# Altium project sonar_board_rev_2013A.PrjPcb
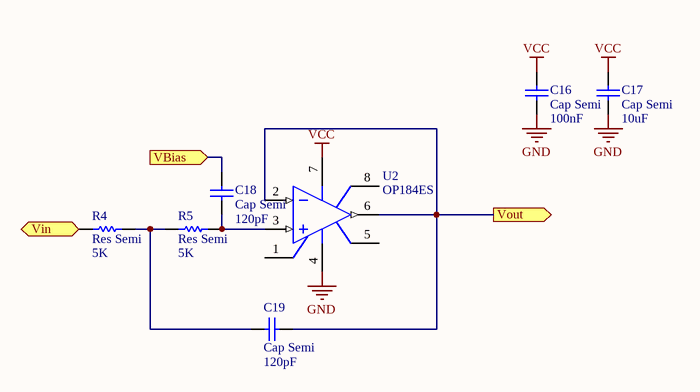
[diagram p0: Sallen_key_LPF.SchDoc]
8 sheets, 123 parts. Net scope: hierarchical (ports join the sheet entries above them; power ports are global).
Board file: Sonar_board.PcbDoc
Sheets:
  Sallen_key_LPF.SchDoc
  sonar_board_rev_2013A.SchDoc
    Pair_A = prototype_dual_channel.SchDoc
      Single_channel_VMA = voltage_mode_preamplifier.SchDoc
      Single_channel_VMA2 = voltage_mode_preamplifier.SchDoc
      Biasing_circuitry = bias_LNA.SchDoc
      Biasing_circuitry = bias_LNA.SchDoc
    Pair_B = prototype_dual_channel.SchDoc
      Single_channel_VMA = voltage_mode_preamplifier.SchDoc
      Single_channel_VMA2 = voltage_mode_preamplifier.SchDoc
      Biasing_circuitry = bias_LNA.SchDoc
      Biasing_circuitry = bias_LNA.SchDoc
    Stack_breakout = main_stack_dual_channel.SchDoc
    ADC_power = power_management.SchDoc
    sonar_extras = sonar_peripherals.SchDoc

## Sheet Sallen_key_LPF.SchDoc
size A

### Parts
C16  Cap Semi  value 100nF  [C0805]
C17  Cap Semi  value 10uF  [C0805]
C18  Cap Semi  value 120pF  [C0805]
C19  Cap Semi  value 120pF  [C0805]
R4  Res Semi  value 5K  [6-0805_M]
R5  Res Semi  value 5K  [6-0805_M]
U2  OP184ES  [SO-8]

### Ports
VBias (in), Vin, Vout (out)

### Nets
GND: C16.1 C17.1 U2.4(V-)
VCC: C16.2 C17.2 U2.7(V+)
NetC18_1: C18.1 R5.2 U2.3(IN+)
NetC18_2: C18.2 ; port VBias
NetC19_1: C19.1 U2.2(IN-) U2.6(OUT) ; port Vout
NetC19_2: C19.2 R4.2 R5.1
NetR4_1: R4.1 ; port Vin

Not connected (* = marked no-connect by the designer): U2 1(NUL) 5(NUL) 8(NC)

### Library data of the parts
C16-C19 = Cap Semi: Capacitor (Semiconductor SIM Model); Published: 8-Jun-2000; LatestRevisionDate: 29-May-2009; LatestRevisionNote: IPC-7351 Footprint Added.; PackageReference: C1206; Publisher: Altium Limited; PackageDescription: Chip Capacitor
R4 R5 = Res Semi: Semiconductor Resistor; Published: 8-Jun-2000; LatestRevisionDate: 17-Jul-2002; LatestRevisionNote: Re-released for DXP Platform.; PackageReference: AXIAL-0.5; Publisher: Altium Limited
U2 = OP184ES: Precision Rail-to-Rail Input and Ouput Operational Amplifier; Note: Pin 8 is not connected.; Published: 8-Jun-2000; LatestRevisionDate: 13-Apr-2006; LatestRevisionNote: IPC-7351 Footprint Added.; DatasheetVersion: REV. 0 1996; PackageVersion: revA; PackageReference: SO-8; Publisher: Altium Limited; PackageDescription: 8-Pin Small Outline Integrated Circuit 1.27 mm Pitch; Code_JEDEC: MS-012-AA; Code_IPC: SOIC127P600-8; ComponentLink1Description: Manufacturer Link; ComponentLink1URL: http://www.analog.com/en/prod/0,,759_786_OP184%2C00.html; ComponentLink2Description: Datasheet; ComponentLink2URL: http://www.analog.com/UploadedFiles/Data_Sheets/390492658OP184_284_484_b.pdf

## Sheet sonar_board_rev_2013A.SchDoc
size A
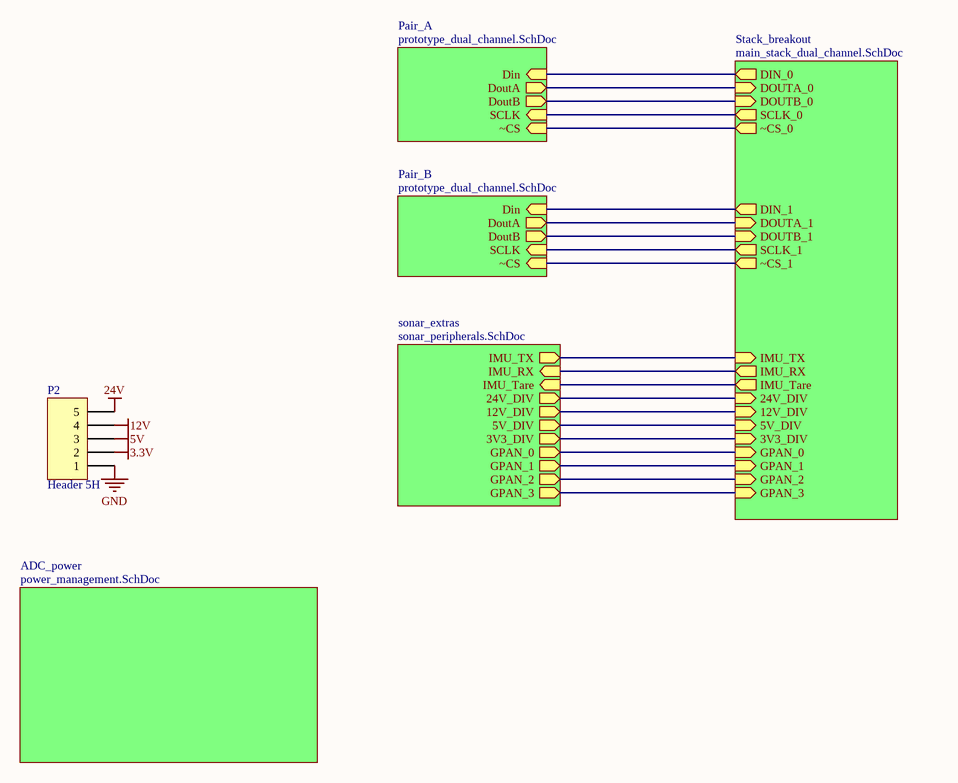
[diagram p1: sonar_board_rev_2013A.SchDoc]

### Parts
P2  Header 5H  [Molex_Minifit_JR_5CKT]

### Sub-sheets
ADC_power = power_management.SchDoc: no entries
Pair_A = prototype_dual_channel.SchDoc: Din (in), DoutA (out), DoutB (out), SCLK (in), ~CS (in)
Pair_B = prototype_dual_channel.SchDoc: SCLK (in), ~CS (in), DoutA (out), DoutB (out), Din (in)
sonar_extras = sonar_peripherals.SchDoc: IMU_TX (out), IMU_RX (in), IMU_Tare (in), 24V_DIV (out), 12V_DIV (out), 5V_DIV (out), 3V3_DIV (out), GPAN_1 (out), GPAN_2 (out), GPAN_3 (out), GPAN_0 (out)
Stack_breakout = main_stack_dual_channel.SchDoc: DIN_0 (out), DIN_1 (out), DOUTA_0 (in), DOUTA_1 (in), DOUTB_0 (in), DOUTB_1 (in), SCLK_0 (out), SCLK_1 (out), ~CS_0 (out), ~CS_1 (out), IMU_TX (in), IMU_RX (out), IMU_Tare (out), 24V_DIV (in), 12V_DIV (in), 5V_DIV (in), 3V3_DIV (in), GPAN_1 (in), GPAN_3 (in), GPAN_0 (in), GPAN_2 (in)

### Nets
3.3V: P2.2
5V: P2.3
12V: P2.4
24V: P2.5
GND: P2.1
NetADC1_1_23: sheet Pair_A/Din, sheet Stack_breakout/DIN_0
NetADC1_1_31: sheet Pair_A/DoutB, sheet Stack_breakout/DOUTB_0
NetADC1_1_32: sheet Pair_A/DoutA, sheet Stack_breakout/DOUTA_0
NetADC1_1_34: sheet Pair_A/SCLK, sheet Stack_breakout/SCLK_0
NetADC1_1_35: sheet Pair_A/~CS, sheet Stack_breakout/~CS_0
NetADC1_2_23: sheet Pair_B/Din, sheet Stack_breakout/DIN_1
NetADC1_2_31: sheet Pair_B/DoutB, sheet Stack_breakout/DOUTB_1
NetADC1_2_32: sheet Pair_B/DoutA, sheet Stack_breakout/DOUTA_1
NetADC1_2_34: sheet Pair_B/SCLK, sheet Stack_breakout/SCLK_1
NetADC1_2_35: sheet Pair_B/~CS, sheet Stack_breakout/~CS_1
NetC24#2_2: sheet Stack_breakout/GPAN_0, sheet sonar_extras/GPAN_0
NetC25_2: sheet Stack_breakout/24V_DIV, sheet sonar_extras/24V_DIV
NetC26_2: sheet Stack_breakout/GPAN_1, sheet sonar_extras/GPAN_1
NetC27_2: sheet Stack_breakout/12V_DIV, sheet sonar_extras/12V_DIV
NetC28_2: sheet Stack_breakout/GPAN_2, sheet sonar_extras/GPAN_2
NetC29_2: sheet Stack_breakout/5V_DIV, sheet sonar_extras/5V_DIV
NetC30_2: sheet Stack_breakout/GPAN_3, sheet sonar_extras/GPAN_3
NetC31_2: sheet Stack_breakout/3V3_DIV, sheet sonar_extras/3V3_DIV
NetMS_T_97: sheet Stack_breakout/IMU_RX, sheet sonar_extras/IMU_RX
NetMS_T_98: sheet Stack_breakout/IMU_Tare, sheet sonar_extras/IMU_Tare
NetP3_8: sheet Stack_breakout/IMU_TX, sheet sonar_extras/IMU_TX

### Library data of the parts
P2 = Header 5H: Header, 5-Pin, Right Angle; LatestRevisionDate: 17-Jul-2002; LatestRevisionNote: Re-released for DXP Platform.; Publisher: Altium Limited

## Sheet prototype_dual_channel.SchDoc
size A
Used 2 times, as channels Pair_A, Pair_B. Parts and nets are listed once, with the designators drawn on the sheet.
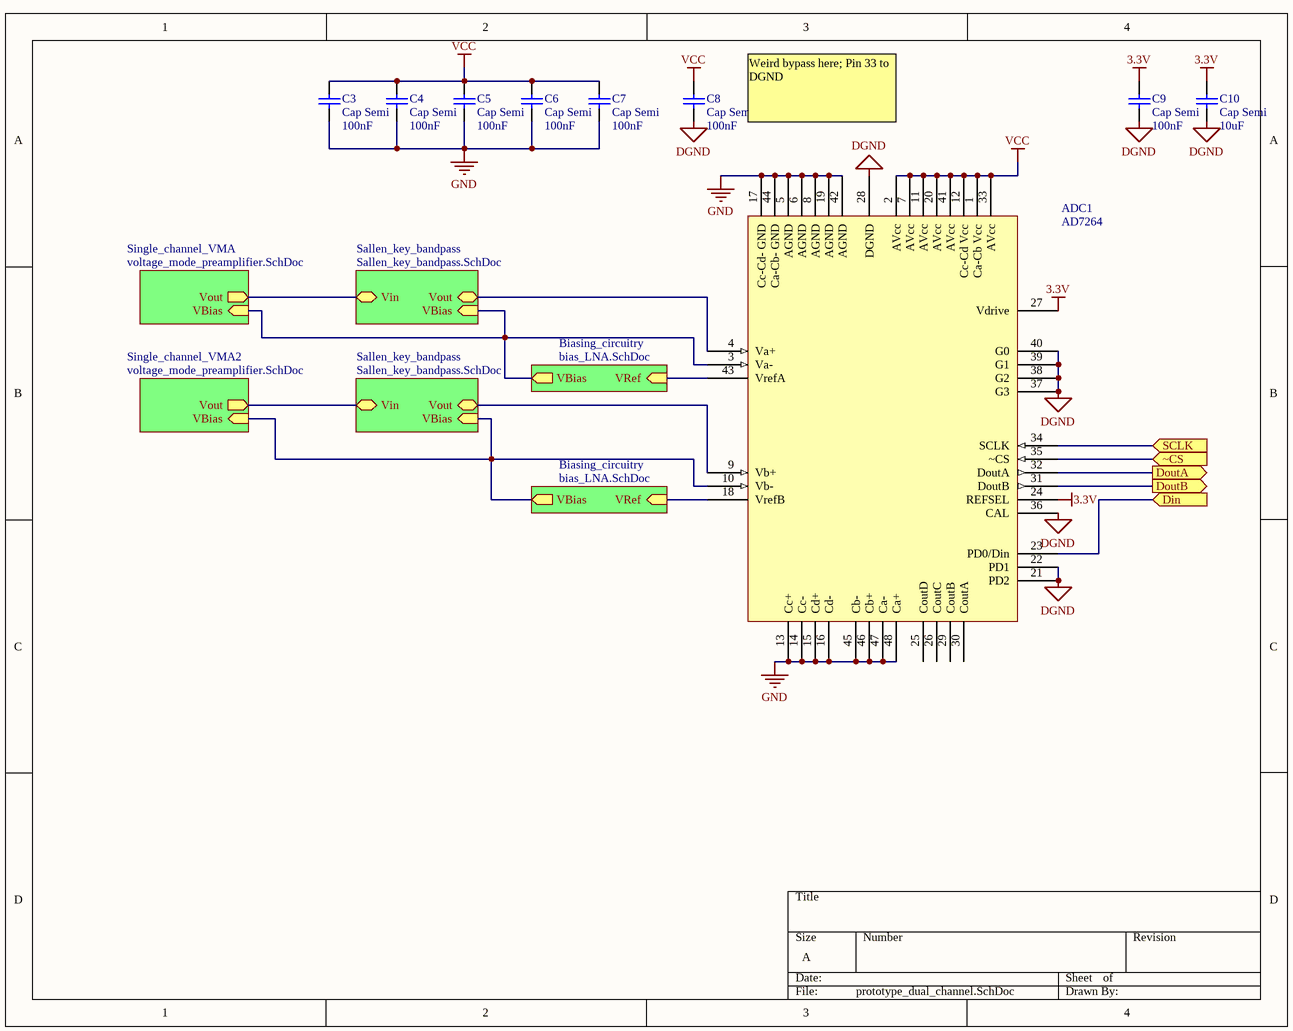
[diagram p2: prototype_dual_channel.SchDoc]

### Parts
ADC1  AD7264  [TSQFP50P900X900-48N]
C3  Cap Semi  value 100nF  [C0805]
C4  Cap Semi  value 100nF  [C0805]
C5  Cap Semi  value 100nF  [C0805]
C6  Cap Semi  value 100nF  [C0805]
C7  Cap Semi  value 100nF  [C0805]
C8  Cap Semi  value 100nF  [C0805]
C9  Cap Semi  value 100nF  [C0805]
C10  Cap Semi  value 10uF  [C0805]

### Sub-sheets
Biasing_circuitry = bias_LNA.SchDoc: VRef (in), VBias (out)
Biasing_circuitry = bias_LNA.SchDoc: VRef (in), VBias (out)
Sallen_key_bandpass = Sallen_key_bandpass.SchDoc (file not in this document): VBias (in), Vin, Vout
Sallen_key_bandpass = Sallen_key_bandpass.SchDoc (file not in this document): VBias (in), Vin, Vout
Single_channel_VMA = voltage_mode_preamplifier.SchDoc: Vout (out), VBias (in)
Single_channel_VMA2 = voltage_mode_preamplifier.SchDoc: Vout (out), VBias (in)

### Ports
Din (in), DoutA (out), DoutB (out), SCLK (in), ~CS (in)

### Nets
3.3V: ADC1.24(REFSEL) ADC1.27(Vdrive) C9.2 C10.2
DGND: ADC1.21(PD2) ADC1.22(PD1) ADC1.28(DGND) ADC1.36(CAL) ADC1.37(G3) ADC1.38(G2) ADC1.39(G1) ADC1.40(G0) C8.1 C9.1 C10.1
GND: ADC1.5(AGND) ADC1.6(AGND) ADC1.8(AGND) ADC1.13(Cc+) ADC1.14(Cc-) ADC1.15(Cd+) ADC1.16(Cd-) ADC1.17(Cc-Cd-_GND) ADC1.19(AGND) ADC1.42(AGND) ADC1.44(Ca-Cb-_GND) ADC1.45(Cb-) ADC1.46(Cb+) ADC1.47(Ca-) ADC1.48(Ca+) C3.1 C4.1 C5.1 C6.1 C7.1
VCC: ADC1.1(Ca-Cb_Vcc) ADC1.2(AVcc) ADC1.7(AVcc) ADC1.11(AVcc) ADC1.12(Cc-Cd_Vcc) ADC1.20(AVcc) ADC1.33(AVcc) ADC1.41(AVcc) C3.2 C4.2 C5.2 C6.2 C7.2 C8.2
Din: ADC1.23(PD0/Din) ; port Din
DoutA: ADC1.32(DoutA) ; port DoutA
DoutB: ADC1.31(DoutB) ; port DoutB
SCLK: ADC1.34(SCLK) ; port SCLK
~CS: ADC1.35(~CS) ; port ~CS
NetADC1_3: ADC1.3(Va-) ; sheet Single_channel_VMA/VBias, sheet Sallen_key_bandpass/VBias, sheet Biasing_circuitry/VBias
NetADC1_4: ADC1.4(Va+) ; sheet Sallen_key_bandpass/Vout
NetADC1_9: ADC1.9(Vb+) ; sheet Sallen_key_bandpass/Vout
NetADC1_10: ADC1.10(Vb-) ; sheet Single_channel_VMA2/VBias, sheet Sallen_key_bandpass/VBias, sheet Biasing_circuitry/VBias
NetADC1_18: ADC1.18(VrefB) ; sheet Biasing_circuitry/VRef
NetADC1_43: ADC1.43(VrefA) ; sheet Biasing_circuitry/VRef
(unnamed): sheet Single_channel_VMA/Vout, sheet Sallen_key_bandpass/Vin
(unnamed): sheet Single_channel_VMA2/Vout, sheet Sallen_key_bandpass/Vin

Not connected (* = marked no-connect by the designer): ADC1 25(CoutD) 26(CoutC) 29(CoutB) 30(CoutA)

### Channels
Pair_A: designators end in _1; ports Din=NetADC1_1_23 DoutA=NetADC1_1_32 DoutB=NetADC1_1_31 SCLK=NetADC1_1_34 ~CS=NetADC1_1_35
Pair_B: designators end in _2; ports Din=NetADC1_2_23 DoutA=NetADC1_2_32 DoutB=NetADC1_2_31 SCLK=NetADC1_2_34 ~CS=NetADC1_2_35

### Notes on the sheet
- Weird bypass here; Pin 33 to DGND

### Library data of the parts
ADC1 = AD7264: AD7264 - 14 bit 1MSPS 2 channel ADC; Datasheet: http://www.analog.com/static/imported-files/data_sheets/AD7264.pdf
C3-C10 = Cap Semi: Capacitor (Semiconductor SIM Model); Published: 8-Jun-2000; LatestRevisionDate: 29-May-2009; LatestRevisionNote: IPC-7351 Footprint Added.; PackageReference: C1206; Publisher: Altium Limited; PackageDescription: Chip Capacitor

## Sheet voltage_mode_preamplifier.SchDoc
size A
Used 4 times, as channels Pair_A/Single_channel_VMA, Pair_A/Single_channel_VMA2, Pair_B/Single_channel_VMA, Pair_B/Single_channel_VMA2. Parts and nets are listed once, with the designators drawn on the sheet.
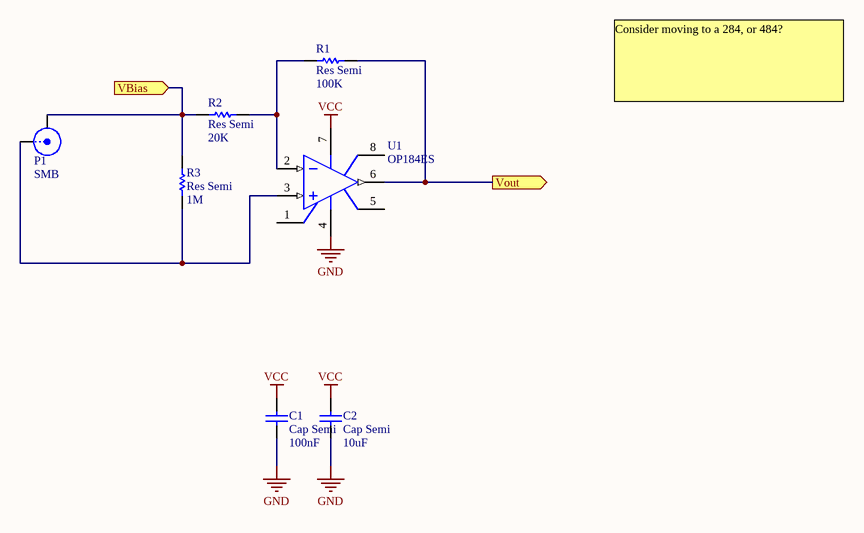
[diagram p3: voltage_mode_preamplifier.SchDoc]

### Parts
C1  Cap Semi  value 100nF  [C0805]
C2  Cap Semi  value 10uF  [C1206]
P1  SMB  [SMA_SMT]
R1  Res Semi  value 100K  [6-0805_M]
R2  Res Semi  value 20K  [6-0805_M]
R3  Res Semi  value 1M  [6-0805_M]
U1  OP184ES  [SO-8]

### Ports
VBias (in), Vout (out)

### Nets
GND: C1.1 C2.1 U1.4(V-)
VCC: C1.2 C2.2 U1.7(V+)
VBias: P1.2(Y) R2.1 R3.2 ; port VBias
Vout: R1.2 U1.6(OUT) ; port Vout
NetP1_1: P1.1(X) R3.1 U1.3(IN+)
NetR1_1: R1.1 R2.2 U1.2(IN-)

Not connected (* = marked no-connect by the designer): U1 1(NUL) 5(NUL) 8(NC)

### Channels
Pair_A/Single_channel_VMA: designators end in _2; ports VBias=NetADC1_1_3 Vout=NetR1_2_2
Pair_A/Single_channel_VMA2: designators end in _1; ports VBias=NetADC1_1_10 Vout=NetR1_1_2
Pair_B/Single_channel_VMA: designators end in _4; ports VBias=NetADC1_2_3 Vout=NetR1_4_2
Pair_B/Single_channel_VMA2: designators end in _3; ports VBias=NetADC1_2_10 Vout=NetR1_3_2

### Notes on the sheet
- Consider moving to a 284, or 484?

### Library data of the parts
C1 C2 = Cap Semi: Capacitor (Semiconductor SIM Model); Published: 8-Jun-2000; LatestRevisionDate: 29-May-2009; LatestRevisionNote: IPC-7351 Footprint Added.; PackageReference: C1206; Publisher: Altium Limited; PackageDescription: Chip Capacitor
P1 = SMB: SMB Straight Connector; LatestRevisionDate: 17-Jul-2002; LatestRevisionNote: Re-released for DXP Platform.; Publisher: Altium Limited; Digikey PN: WM5534-ND
R1-R3 = Res Semi: Semiconductor Resistor; Published: 8-Jun-2000; LatestRevisionDate: 17-Jul-2002; LatestRevisionNote: Re-released for DXP Platform.; PackageReference: AXIAL-0.5; Publisher: Altium Limited
U1 = OP184ES: as U2 on sheet Sallen_key_LPF; Published: 8-Jun-2000; LatestRevisionDate: 13-Apr-2006; LatestRevisionNote: IPC-7351 Footprint Added.; DatasheetVersion: REV. 0 1996; PackageVersion: revA; PackageReference: SO-8; Publisher: Altium Limited; PackageDescription: 8-Pin Small Outline Integrated Circuit 1.27 mm Pitch; Code_JEDEC: MS-012-AA; Code_IPC: SOIC127P600-8; ComponentLink1Description: Manufacturer Link; ComponentLink1URL: http://www.analog.com/en/prod/0,,759_786_OP184%2C00.html; ComponentLink2Description: Datasheet; ComponentLink2URL: http://www.analog.com/UploadedFiles/Data_Sheets/390492658OP184_284_484_b.pdf; Digikey PN: OP184FSZ-REEL7CT-ND

## Sheet bias_LNA.SchDoc
size A
Used 4 times, as channels Pair_A/Biasing_circuitry, Pair_A/Biasing_circuitry, Pair_B/Biasing_circuitry, Pair_B/Biasing_circuitry. Parts and nets are listed once, with the designators drawn on the sheet.
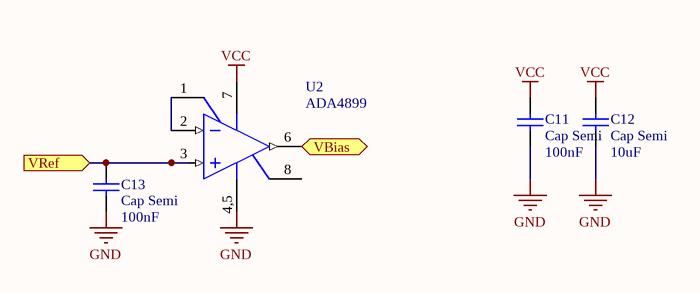
[diagram p4: bias_LNA.SchDoc]

### Parts
C11  Cap Semi  value 100nF  [C0805]
C12  Cap Semi  value 10uF  [C0805]
C13  Cap Semi  value 100nF  [C0805]
U2  ADA4899  [SO8_N]

### Ports
VBias (out), VRef (in)

### Nets
GND: C11.1 C12.1 C13.1 U2.4,5(V-)
VCC: C11.2 C12.2 U2.7(V+)
VBias: U2.6(OUT) ; port VBias
VRef: C13.2 U2.3(IN+) ; port VRef
NetU2_1: U2.1(FB) U2.2(IN-)

Not connected (* = marked no-connect by the designer): U2 8(CMPEN)

### Channels
Pair_A/Biasing_circuitry: designators end in _2; ports VBias=NetADC1_1_3 VRef=NetADC1_1_43
Pair_A/Biasing_circuitry: designators end in _1; ports VBias=NetADC1_1_10 VRef=NetADC1_1_18
Pair_B/Biasing_circuitry: designators end in _4; ports VBias=NetADC1_2_3 VRef=NetADC1_2_43
Pair_B/Biasing_circuitry: designators end in _3; ports VBias=NetADC1_2_10 VRef=NetADC1_2_18

### Library data of the parts
C11-C13 = Cap Semi: Capacitor (Semiconductor SIM Model); Published: 8-Jun-2000; LatestRevisionDate: 29-May-2009; LatestRevisionNote: IPC-7351 Footprint Added.; PackageReference: C1206; Publisher: Altium Limited; PackageDescription: Chip Capacitor
U2 = ADA4899: High Speed, Low Voltage Noise, Unity Gain Stable Op-Amp; Datasheet: http://www.analog.com/static/imported-files/data_sheets/ADA4899-1.pdf; Digikey Product Sheet: http://www.digikey.ca/product-search/en/integrated-circuits-ics/linear-amplifiers-instrumentation-op-amps-buffer-amps/2556125?k=ADA4899

## Sheet main_stack_dual_channel.SchDoc
size A
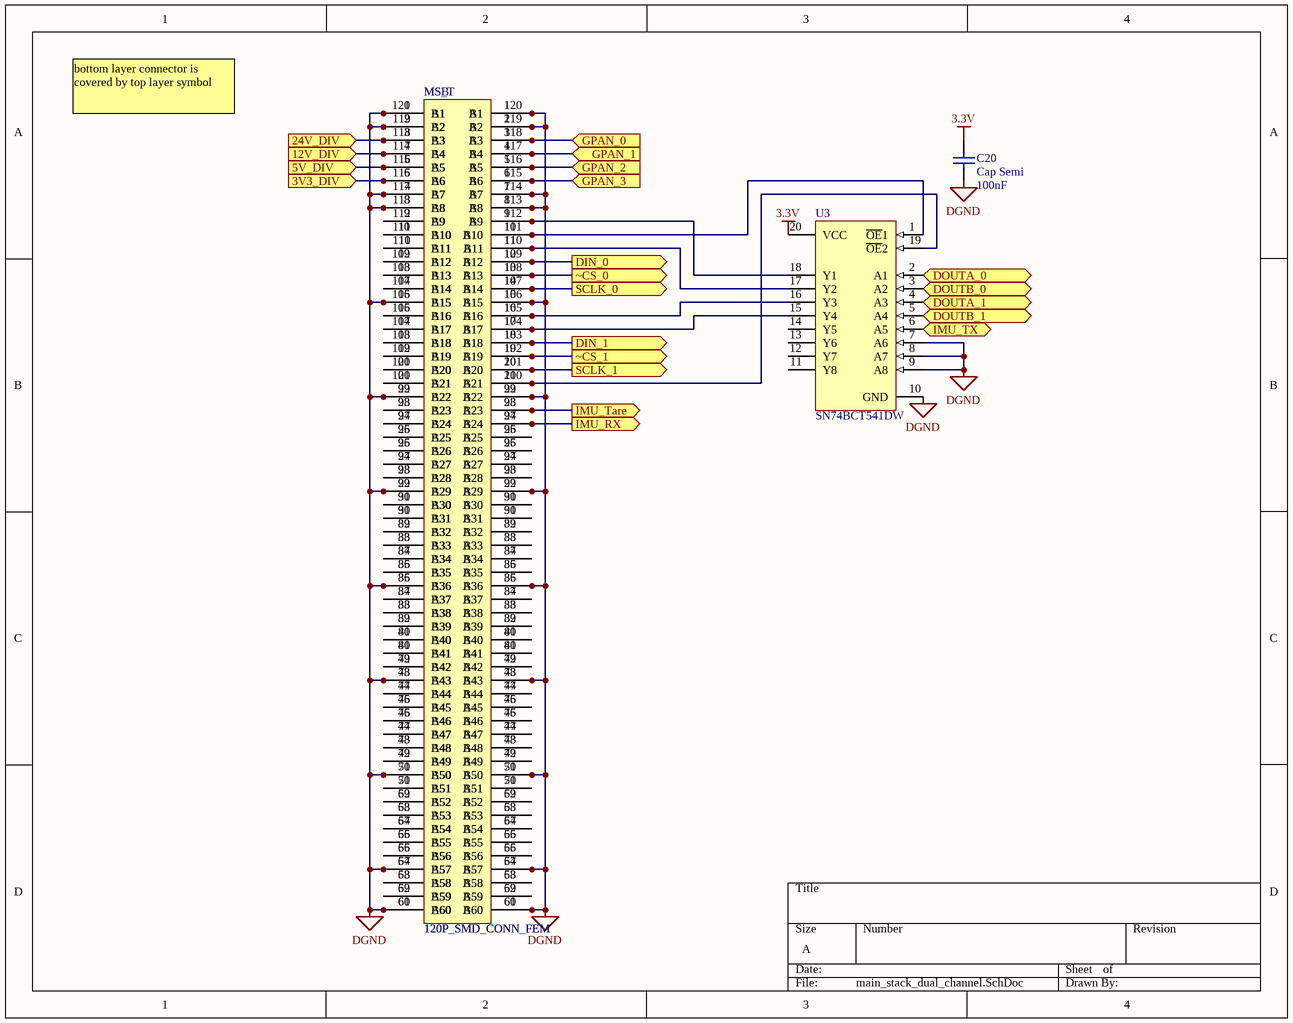
[diagram p5: main_stack_dual_channel.SchDoc]

### Parts
C20  Cap Semi  value 100nF  [C0805]
MS_T  120P_SMD_CONN_FEM  [FX2-120P-1.27SV]
MSB  120P_SMD_CONN_FEM  [FX2-120P-1.27SV]
U3  SN74BCT541DW  [DW020]

### Ports
3V3_DIV (in), 5V_DIV (in), 12V_DIV (in), 24V_DIV (in), DIN_0 (out), DIN_1 (out), DOUTA_0 (in), DOUTA_1 (in), DOUTB_0 (in), DOUTB_1 (in), GPAN_0 (in), GPAN_1 (in), GPAN_2 (in), GPAN_3 (in), IMU_RX (out), IMU_Tare (out), IMU_TX (in), SCLK_0 (out), SCLK_1 (out), ~CS_0 (out), ~CS_1 (out)

### Nets
3.3V: C20.2 U3.20(VCC)
DGND: C20.1 MS_T.1(A1) MS_T.2(A2) MS_T.7(A7) MS_T.8(A8) MS_T.15(A15) MS_T.22(A22) MS_T.29(A29) MS_T.36(A36) MS_T.43(A43) MS_T.50(A50) MS_T.57(A57) MS_T.60(A60) MS_T.61(B60) MS_T.64(B57) MS_T.71(B50) MS_T.78(B43) MS_T.85(B36) MS_T.92(B29) MS_T.99(B22) MS_T.106(B15) MS_T.113(B8) MS_T.114(B7) MS_T.119(B2) MS_T.120(B1) MSB.1(A1) MSB.2(A2) MSB.7(A7) MSB.8(A8) MSB.15(A15) MSB.22(A22) MSB.29(A29) MSB.36(A36) MSB.43(A43) MSB.50(A50) MSB.57(A57) MSB.60(A60) MSB.61(B60) MSB.64(B57) MSB.71(B50) MSB.78(B43) MSB.85(B36) MSB.92(B29) MSB.99(B22) MSB.106(B15) MSB.113(B8) MSB.114(B7) MSB.119(B2) MSB.120(B1) U3.7(A6) U3.8(A7) U3.9(A8) U3.10(GND)
NetADC1_1_23: MS_T.109(B12) MSB.12(A12) ; port DIN_0
NetADC1_1_31: U3.3(A2) ; port DOUTB_0
NetADC1_1_32: U3.2(A1) ; port DOUTA_0
NetADC1_1_34: MS_T.107(B14) MSB.14(A14) ; port SCLK_0
NetADC1_1_35: MS_T.108(B13) MSB.13(A13) ; port ~CS_0
NetADC1_2_23: MS_T.103(B18) MSB.18(A18) ; port DIN_1
NetADC1_2_31: U3.5(A4) ; port DOUTB_1
NetADC1_2_32: U3.4(A3) ; port DOUTA_1
NetADC1_2_34: MS_T.101(B20) MSB.20(A20) ; port SCLK_1
NetADC1_2_35: MS_T.102(B19) MSB.19(A19) ; port ~CS_1
NetC24#2_2: MS_T.118(B3) MSB.3(A3) ; port GPAN_0
NetC25_2: MS_T.3(A3) MSB.118(B3) ; port 24V_DIV
NetC26_2: MS_T.117(B4) MSB.4(A4) ; port GPAN_1
NetC27_2: MS_T.4(A4) MSB.117(B4) ; port 12V_DIV
NetC28_2: MS_T.116(B5) MSB.5(A5) ; port GPAN_2
NetC29_2: MS_T.5(A5) MSB.116(B5) ; port 5V_DIV
NetC30_2: MS_T.115(B6) MSB.6(A6) ; port GPAN_3
NetC31_2: MS_T.6(A6) MSB.115(B6) ; port 3V3_DIV
NetMS_T_9: MS_T.9(A9) MSB.112(B9)
NetMS_T_10: MS_T.10(A10) MSB.111(B10)
NetMS_T_11: MS_T.11(A11) MSB.110(B11)
NetMS_T_12: MS_T.12(A12) MSB.109(B12)
NetMS_T_13: MS_T.13(A13) MSB.108(B13)
NetMS_T_14: MS_T.14(A14) MSB.107(B14)
NetMS_T_16: MS_T.16(A16) MSB.105(B16)
NetMS_T_17: MS_T.17(A17) MSB.104(B17)
NetMS_T_18: MS_T.18(A18) MSB.103(B18)
NetMS_T_19: MS_T.19(A19) MSB.102(B19)
NetMS_T_20: MS_T.20(A20) MSB.101(B20)
NetMS_T_21: MS_T.21(A21) MSB.100(B21)
NetMS_T_23: MS_T.23(A23) MSB.98(B23)
NetMS_T_24: MS_T.24(A24) MSB.97(B24)
NetMS_T_25: MS_T.25(A25) MSB.96(B25)
NetMS_T_26: MS_T.26(A26) MSB.95(B26)
NetMS_T_27: MS_T.27(A27) MSB.94(B27)
NetMS_T_28: MS_T.28(A28) MSB.93(B28)
NetMS_T_30: MS_T.30(A30) MSB.91(B30)
NetMS_T_31: MS_T.31(A31) MSB.90(B31)
NetMS_T_32: MS_T.32(A32) MSB.89(B32)
NetMS_T_33: MS_T.33(A33) MSB.88(B33)
NetMS_T_34: MS_T.34(A34) MSB.87(B34)
NetMS_T_35: MS_T.35(A35) MSB.86(B35)
NetMS_T_37: MS_T.37(A37) MSB.84(B37)
NetMS_T_38: MS_T.38(A38) MSB.83(B38)
NetMS_T_39: MS_T.39(A39) MSB.82(B39)
NetMS_T_40: MS_T.40(A40) MSB.81(B40)
NetMS_T_41: MS_T.41(A41) MSB.80(B41)
NetMS_T_42: MS_T.42(A42) MSB.79(B42)
NetMS_T_44: MS_T.44(A44) MSB.77(B44)
NetMS_T_45: MS_T.45(A45) MSB.76(B45)
NetMS_T_46: MS_T.46(A46) MSB.75(B46)
NetMS_T_47: MS_T.47(A47) MSB.74(B47)
NetMS_T_48: MS_T.48(A48) MSB.73(B48)
NetMS_T_49: MS_T.49(A49) MSB.72(B49)
NetMS_T_51: MS_T.51(A51) MSB.70(B51)
NetMS_T_52: MS_T.52(A52) MSB.69(B52)
NetMS_T_53: MS_T.53(A53) MSB.68(B53)
NetMS_T_54: MS_T.54(A54) MSB.67(B54)
NetMS_T_55: MS_T.55(A55) MSB.66(B55)
NetMS_T_56: MS_T.56(A56) MSB.65(B56)
NetMS_T_58: MS_T.58(A58) MSB.63(B58)
NetMS_T_59: MS_T.59(A59) MSB.62(B59)
NetMS_T_62: MS_T.62(B59) MSB.59(A59)
NetMS_T_63: MS_T.63(B58) MSB.58(A58)
NetMS_T_65: MS_T.65(B56) MSB.56(A56)
NetMS_T_66: MS_T.66(B55) MSB.55(A55)
NetMS_T_67: MS_T.67(B54) MSB.54(A54)
NetMS_T_68: MS_T.68(B53) MSB.53(A53)
NetMS_T_69: MS_T.69(B52) MSB.52(A52)
NetMS_T_70: MS_T.70(B51) MSB.51(A51)
NetMS_T_72: MS_T.72(B49) MSB.49(A49)
NetMS_T_73: MS_T.73(B48) MSB.48(A48)
NetMS_T_74: MS_T.74(B47) MSB.47(A47)
NetMS_T_75: MS_T.75(B46) MSB.46(A46)
NetMS_T_76: MS_T.76(B45) MSB.45(A45)
NetMS_T_77: MS_T.77(B44) MSB.44(A44)
NetMS_T_79: MS_T.79(B42) MSB.42(A42)
NetMS_T_80: MS_T.80(B41) MSB.41(A41)
NetMS_T_81: MS_T.81(B40) MSB.40(A40)
NetMS_T_82: MS_T.82(B39) MSB.39(A39)
NetMS_T_83: MS_T.83(B38) MSB.38(A38)
NetMS_T_84: MS_T.84(B37) MSB.37(A37)
NetMS_T_86: MS_T.86(B35) MSB.35(A35)
NetMS_T_87: MS_T.87(B34) MSB.34(A34)
NetMS_T_88: MS_T.88(B33) MSB.33(A33)
NetMS_T_89: MS_T.89(B32) MSB.32(A32)
NetMS_T_90: MS_T.90(B31) MSB.31(A31)
NetMS_T_91: MS_T.91(B30) MSB.30(A30)
NetMS_T_93: MS_T.93(B28) MSB.28(A28)
NetMS_T_94: MS_T.94(B27) MSB.27(A27)
NetMS_T_95: MS_T.95(B26) MSB.26(A26)
NetMS_T_96: MS_T.96(B25) MSB.25(A25)
NetMS_T_97: MS_T.97(B24) MSB.24(A24) ; port IMU_RX
NetMS_T_98: MS_T.98(B23) MSB.23(A23) ; port IMU_Tare
NetMS_T_100: MS_T.100(B21) MSB.21(A21) U3.19(~{OE}2)
NetMS_T_104: MS_T.104(B17) MSB.17(A17) U3.15(Y4)
NetMS_T_105: MS_T.105(B16) MSB.16(A16) U3.16(Y3)
NetMS_T_110: MS_T.110(B11) MSB.11(A11) U3.17(Y2)
NetMS_T_111: MS_T.111(B10) MSB.10(A10) U3.1(~{OE}1)
NetMS_T_112: MS_T.112(B9) MSB.9(A9) U3.18(Y1)
NetP3_8: U3.6(A5) ; port IMU_TX

Not connected (* = marked no-connect by the designer): U3 11(Y8) 12(Y7) 13(Y6) 14(Y5)

### Notes on the sheet
- bottom layer connector is covered by top layer symbol

### Library data of the parts
C20 = Cap Semi: Capacitor (Semiconductor SIM Model); Published: 8-Jun-2000; LatestRevisionDate: 29-May-2009; LatestRevisionNote: IPC-7351 Footprint Added.; PackageReference: C1206; Publisher: Altium Limited; PackageDescription: Chip Capacitor
MS_T MSB = 120P_SMD_CONN_FEM: Main Stack Connector, Female; Part Number: FX2-120P-1.27SV(71)
  MSB: Datasheet: http://www.hirose.co.jp/cataloge_hp/e57220088.pdf
U3 = SN74BCT541DW: Octal Buffer/Driver with 3-State Outputs; ComponentAvailability: Obsolete; Published: 8-Jun-2000; LatestRevisionDate: 13-Apr-2006; LatestRevisionNote: IPC-7351 Footprint Added.; DatasheetVersion: Apr-1994; PackageVersion: Mar-2000; PackageReference: DW020; Publisher: Altium Limited; PackageDescription: 20-Pin Plastic Small Outline Integrated Circuit 1.27 mm Pitch; Code_JEDEC: MS-013; Code_IPC: SOIC127P1030-20; ComponentLink1Description: Manufacturer Link; ComponentLink1URL: http://www.ti.com/; ComponentLink2Description: Discontinuation Notice; ComponentLink2URL: http://focus.ti.com/docs/prod/folders/print/sn74bct541.html; Datasheet: http://www.ti.com/lit/ds/symlink/sn74bct541a.pdf; Digikey PN: 296-33840-5-ND

## Sheet power_management.SchDoc
size A
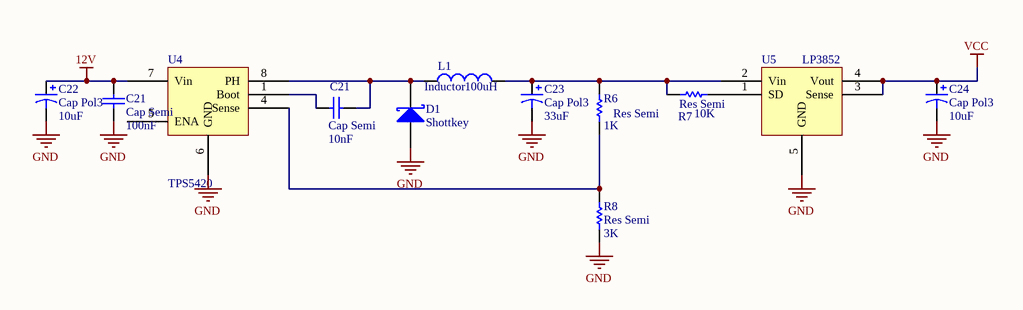
[diagram p6: power_management.SchDoc]

### Parts
(Parts that share a designator on the sheet are numbered #1, #2 ... from top to bottom, then left to right.)
C21#1  Cap Semi  value 10nF  [C0805]
C21#2  Cap Semi  value 100nF  [C0805]
C22  Cap Pol3  value 10uF  [TC6032-2412]
C23  Cap Pol3  value 33uF  [TC6032-2412]
C24#1  Cap Pol3  value 10uF  [TC3216-1206]
D1  Shottkey  [TO-220AC]
L1  Inductor  value 100uH  [SB_IND]
R6  Res Semi  value 1K  [6-0805_M]
R7  Res Semi  value 10K  [6-0805_M]
R8  Res Semi  value 3K  [6-0805_M]
U4  TPS5420  [SO8_M]
U5  LP3852  [SOT223-5N]

### Nets
12V: C21#2.2 C22.1 U4.7(Vin)
GND: C21#2.1 C22.2 C23.2 C24#1.2 D1.3(A) R8.1 U4.6(GND) U5.5(GND)
VCC: C24#1.1 U5.3(Sense) U5.4(Vout)
NetC21#1_1: C21#1.1 U4.1(Boot)
NetC21#1_2: C21#1.2 D1.1(K) L1.1 U4.8(PH)
NetC23_1: C23.1 L1.2 R6.2 R7.1 U5.2(Vin)
NetR6_1: R6.1 R8.2 U4.4(Sense)
NetR7_2: R7.2 U5.1(SD)

Not connected (* = marked no-connect by the designer): U4 5(ENA)

### Library data of the parts
C21#1 C21#2 = Cap Semi: Capacitor (Semiconductor SIM Model); Published: 8-Jun-2000; LatestRevisionDate: 29-May-2009; LatestRevisionNote: IPC-7351 Footprint Added.; PackageReference: C1206; Publisher: Altium Limited; PackageDescription: Chip Capacitor
C22 C23 C24#1 = Cap Pol3: Polarized Capacitor (Surface Mount); Published: 8-Jun-2000; LatestRevisionDate: 29-May-2009; LatestRevisionNote: IPC-7351 Footprint Added.; PackageReference: C0805; Publisher: Altium Limited; PackageDescription: Chip Capacitor
  C22: Digikey PN: 718-1052-6-ND
  C23: Digikey PN: 718-1077-1-ND
D1 = Diode 10TQ035: Schottky Rectifier; Note: Terminal 2 is the TAB and is electrically connected to the cathode; Published: 8-Jun-2000; LatestRevisionDate: 17-Jul-2002; LatestRevisionNote: Re-released for DXP Platform.; DatasheetVersion: PD-2.057B; PackageVersion: Feb-1998; PackageReference: TO-220AC; Publisher: Altium Limited; PackageDescription: TO, Thru-Hole, Vertical, Heatsink Mounted; 3 In-Line Leads (1 Absent); Pitch 2.54 mm; ComponentLink1Description: Manufacturer Link; ComponentLink1URL: http://www.irf.com/; ComponentLink2Description: Datasheet; ComponentLink2URL: http://www.irf.com/product-info/datasheets/data/10tq.pdf; Digikey PN: B340A-FDICT-ND
L1 = Inductor: Code_IEC: 1005; Published: 8-Jun-2000; LatestRevisionDate: 29-May-2009; LatestRevisionNote: IPC-7351 Footprint Added.; PackageReference: 0402-A; Publisher: Altium Limited; PackageDescription: Chip Inductor; Code_JEITA: 0402; Digikey PN: 495-1987-1-ND
R6-R8 = Res Semi: Semiconductor Resistor; Published: 8-Jun-2000; LatestRevisionDate: 17-Jul-2002; LatestRevisionNote: Re-released for DXP Platform.; PackageReference: AXIAL-0.5; Publisher: Altium Limited
  R6 R8: PackageDescription: Axial Device, Thru-Hole; 2 Leads; 0.5 in Pin Spacing
U4 = TPS5420: 2A Wide Input Range Step-Down Swift Converter; Datasheet: http://www.ti.com/lit/ds/symlink/tps5420.pdf; Digikey PN: 296-19671-5-ND
U5 = LP3852: 1.5A Fast Response Ultra Low Dropout Linear Regulator; Digikey PN: LP3852EMP-5.0/NOPBCT-ND; Datasheet: http://www.ti.com/lit/ds/symlink/lp3852.pdf

## Sheet sonar_peripherals.SchDoc
size A
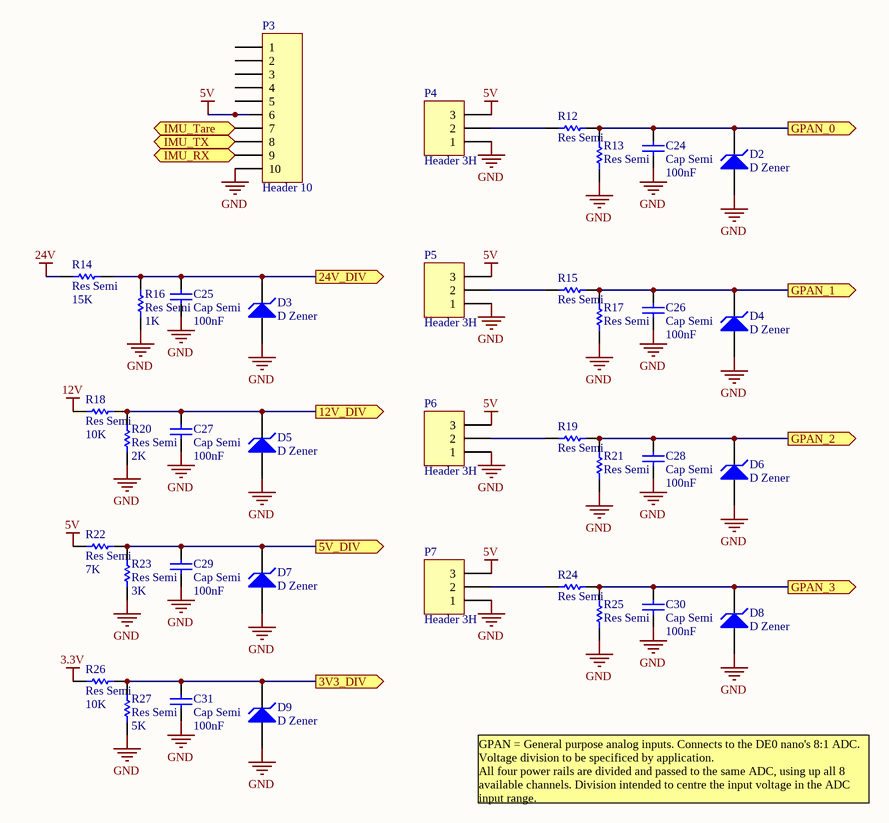
[diagram p7: sonar_peripherals.SchDoc]

### Parts
(Parts that share a designator on the sheet are numbered #1, #2 ... from top to bottom, then left to right.)
C24#2  Cap Semi  value 100nF  [C0805]
C25  Cap Semi  value 100nF  [C0805]
C26  Cap Semi  value 100nF  [C0805]
C27  Cap Semi  value 100nF  [C0805]
C28  Cap Semi  value 100nF  [C0805]
C29  Cap Semi  value 100nF  [C0805]
C30  Cap Semi  value 100nF  [C0805]
C31  Cap Semi  value 100nF  [C0805]
D2  D Zener  [SOD-323]
D3  D Zener  [SOD-323]
D4  D Zener  [SOD-323]
D5  D Zener  [SOD-323]
D6  D Zener  [SOD-323]
D7  D Zener  [SOD-323]
D8  D Zener  [SOD-323]
D9  D Zener  [SOD-323]
P3  Header 10  [Harwin_IMU_recp]
P4  Header 3H  [HDR1X3H]
P5  Header 3H  [HDR1X3H]
P6  Header 3H  [HDR1X3H]
P7  Header 3H  [HDR1X3H]
R12  Res Semi  [6-0805_M]
R13  Res Semi  [6-0805_M]
R14  Res Semi  value 15K  [6-0805_M]
R15  Res Semi  [6-0805_M]
R16  Res Semi  value 1K  [6-0805_M]
R17  Res Semi  [6-0805_M]
R18  Res Semi  value 10K  [6-0805_M]
R19  Res Semi  [6-0805_M]
R20  Res Semi  value 2K  [6-0805_M]
R21  Res Semi  [6-0805_M]
R22  Res Semi  value 7K  [6-0805_M]
R23  Res Semi  value 3K  [6-0805_M]
R24  Res Semi  [6-0805_M]
R25  Res Semi  [6-0805_M]
R26  Res Semi  value 10K  [6-0805_M]
R27  Res Semi  value 5K  [6-0805_M]

### Ports
3V3_DIV (out), 5V_DIV (out), 12V_DIV (out), 24V_DIV (out), GPAN_0 (out), GPAN_1 (out), GPAN_2 (out), GPAN_3 (out), IMU_RX (in), IMU_Tare (in), IMU_TX (out)

### Nets
3.3V: R26.1
5V: P3.6 P4.3 P5.3 P6.3 P7.3 R22.1
12V: R18.1
24V: R14.1
GND: C24#2.1 C25.1 C26.1 C27.1 C28.1 C29.1 C30.1 C31.1 D2.1(A) D3.1(A) D4.1(A) D5.1(A) D6.1(A) D7.1(A) D8.1(A) D9.1(A) P3.10 P4.1 P5.1 P6.1 P7.1 R13.1 R16.1 R17.1 R20.1 R21.1 R23.1 R25.1 R27.1
NetC24#2_2: C24#2.2 D2.2(K) R12.2 R13.2 ; port GPAN_0
NetC25_2: C25.2 D3.2(K) R14.2 R16.2 ; port 24V_DIV
NetC26_2: C26.2 D4.2(K) R15.2 R17.2 ; port GPAN_1
NetC27_2: C27.2 D5.2(K) R18.2 R20.2 ; port 12V_DIV
NetC28_2: C28.2 D6.2(K) R19.2 R21.2 ; port GPAN_2
NetC29_2: C29.2 D7.2(K) R22.2 R23.2 ; port 5V_DIV
NetC30_2: C30.2 D8.2(K) R24.2 R25.2 ; port GPAN_3
NetC31_2: C31.2 D9.2(K) R26.2 R27.2 ; port 3V3_DIV
NetMS_T_97: P3.9 ; port IMU_RX
NetMS_T_98: P3.7 ; port IMU_Tare
NetP3_8: P3.8 ; port IMU_TX
NetP4_2: P4.2 R12.1
NetP5_2: P5.2 R15.1
NetP6_2: P6.2 R19.1
NetP7_2: P7.2 R24.1

Not connected (* = marked no-connect by the designer): P3 1 2 3 4 5

### Notes on the sheet
- GPAN = General purpose analog inputs. Connects to the DE0 nano's 8:1 ADC.  Voltage division to be specificed by application.
  All four power rails are divided and passed to the same ADC, using up all 8 available channels. Division intended to centre the input voltage in the ADC input range.

### Library data of the parts
C24#2 C25-C31 = Cap Semi: Capacitor (Semiconductor SIM Model); Published: 8-Jun-2000; LatestRevisionDate: 29-May-2009; LatestRevisionNote: IPC-7351 Footprint Added.; PackageReference: C1206; Publisher: Altium Limited; PackageDescription: Chip Capacitor
D2-D9 = D Zener: Zener Diode; Published: 8-Jun-2000; LatestRevisionDate: 17-Jul-2002; LatestRevisionNote: Re-released for DXP Platform.; PackageReference: DIODE-0.7; Publisher: Altium Limited; PackageDescription: Diode, Thru-Hole; 2 Leads; 0.7 in Pin Spacing
P3 = Header 10: Header, 10-Pin; Manufacturer PN: M80-5401042; LatestRevisionDate: 17-Jul-2002; LatestRevisionNote: Re-released for DXP Platform.; Publisher: Altium Limited; Mouser PN: 855-M80-5401042
P4-P7 = Header 3H: Header, 3-Pin, Right Angle; LatestRevisionDate: 17-Jul-2002; LatestRevisionNote: Re-released for DXP Platform.; Publisher: Altium Limited
R12 R15 R19 R24 = Res Semi: Semiconductor Resistor; Value: 10K; Published: 8-Jun-2000; LatestRevisionDate: 17-Jul-2002; LatestRevisionNote: Re-released for DXP Platform.; PackageReference: AXIAL-0.5; Publisher: Altium Limited; PackageDescription: Axial Device, Thru-Hole; 2 Leads; 0.5 in Pin Spacing
R13 R17 R21 R25 = Res Semi: Semiconductor Resistor; Value: 2K; Published: 8-Jun-2000; LatestRevisionDate: 17-Jul-2002; LatestRevisionNote: Re-released for DXP Platform.; PackageReference: AXIAL-0.5; Publisher: Altium Limited; PackageDescription: Axial Device, Thru-Hole; 2 Leads; 0.5 in Pin Spacing
R14 R16 R18 R20 R22 R23 R26 R27 = Res Semi: Semiconductor Resistor; Published: 8-Jun-2000; LatestRevisionDate: 17-Jul-2002; LatestRevisionNote: Re-released for DXP Platform.; PackageReference: AXIAL-0.5; Publisher: Altium Limited; PackageDescription: Axial Device, Thru-Hole; 2 Leads; 0.5 in Pin Spacing

## Nets that join several sheets
3.3V: sonar_board_rev_2013A (P2.2), Pair_A (ADC1_1.24 ADC1_1.27 C9_1.2 C10_1.2), Pair_B (ADC1_2.24 ADC1_2.27 C9_2.2 C10_2.2), main_stack_dual_channel (C20.2 U3.20), sonar_peripherals (R26.1)
5V: sonar_board_rev_2013A (P2.3), sonar_peripherals (6 pins)
12V: sonar_board_rev_2013A (P2.4), power_management (C21#2.2 C22.1 U4.7), sonar_peripherals (R18.1)
24V: sonar_board_rev_2013A (P2.5), sonar_peripherals (R14.1)
DGND: Pair_A (11 pins), Pair_B (11 pins), main_stack_dual_channel (53 pins)
GND: Sallen_key_LPF (C16.1 C17.1 U2.4), sonar_board_rev_2013A (P2.1), Pair_A (20 pins), Pair_A/Single_channel_VMA (C1_2.1 C2_2.1 U1_2.4), Pair_A/Single_channel_VMA2 (C1_1.1 C2_1.1 U1_1.4), Pair_A/Biasing_circuitry (C11_2.1 C12_2.1 C13_2.1 U2_2.4,5), Pair_A/Biasing_circuitry (C11_1.1 C12_1.1 C13_1.1 U2_1.4,5), Pair_B (20 pins), Pair_B/Single_channel_VMA (C1_4.1 C2_4.1 U1_4.4), Pair_B/Single_channel_VMA2 (C1_3.1 C2_3.1 U1_3.4), Pair_B/Biasing_circuitry (C11_4.1 C12_4.1 C13_4.1 U2_4.4,5), Pair_B/Biasing_circuitry (C11_3.1 C12_3.1 C13_3.1 U2_3.4,5), power_management (8 pins), sonar_peripherals (29 pins)
VCC: Sallen_key_LPF (C16.2 C17.2 U2.7), Pair_A (14 pins), Pair_A/Single_channel_VMA (C1_2.2 C2_2.2 U1_2.7), Pair_A/Single_channel_VMA2 (C1_1.2 C2_1.2 U1_1.7), Pair_A/Biasing_circuitry (C11_2.2 C12_2.2 U2_2.7), Pair_A/Biasing_circuitry (C11_1.2 C12_1.2 U2_1.7), Pair_B (14 pins), Pair_B/Single_channel_VMA (C1_4.2 C2_4.2 U1_4.7), Pair_B/Single_channel_VMA2 (C1_3.2 C2_3.2 U1_3.7), Pair_B/Biasing_circuitry (C11_4.2 C12_4.2 U2_4.7), Pair_B/Biasing_circuitry (C11_3.2 C12_3.2 U2_3.7), power_management (C24#1.1 U5.3 U5.4)
NetADC1_1_3: Pair_A (ADC1_1.3), Pair_A/Single_channel_VMA (P1_2.2 R2_2.1 R3_2.2), Pair_A/Biasing_circuitry (U2_2.6)
NetADC1_1_10: Pair_A (ADC1_1.10), Pair_A/Single_channel_VMA2 (P1_1.2 R2_1.1 R3_1.2), Pair_A/Biasing_circuitry (U2_1.6)
NetADC1_1_18: Pair_A (ADC1_1.18), Pair_A/Biasing_circuitry (C13_1.2 U2_1.3)
NetADC1_1_23: Pair_A (ADC1_1.23), main_stack_dual_channel (MS_T.109 MSB.12)
NetADC1_1_31: Pair_A (ADC1_1.31), main_stack_dual_channel (U3.3)
NetADC1_1_32: Pair_A (ADC1_1.32), main_stack_dual_channel (U3.2)
NetADC1_1_34: Pair_A (ADC1_1.34), main_stack_dual_channel (MS_T.107 MSB.14)
NetADC1_1_35: Pair_A (ADC1_1.35), main_stack_dual_channel (MS_T.108 MSB.13)
NetADC1_1_43: Pair_A (ADC1_1.43), Pair_A/Biasing_circuitry (C13_2.2 U2_2.3)
NetADC1_2_3: Pair_B (ADC1_2.3), Pair_B/Single_channel_VMA (P1_4.2 R2_4.1 R3_4.2), Pair_B/Biasing_circuitry (U2_4.6)
NetADC1_2_10: Pair_B (ADC1_2.10), Pair_B/Single_channel_VMA2 (P1_3.2 R2_3.1 R3_3.2), Pair_B/Biasing_circuitry (U2_3.6)
NetADC1_2_18: Pair_B (ADC1_2.18), Pair_B/Biasing_circuitry (C13_3.2 U2_3.3)
NetADC1_2_23: Pair_B (ADC1_2.23), main_stack_dual_channel (MS_T.103 MSB.18)
NetADC1_2_31: Pair_B (ADC1_2.31), main_stack_dual_channel (U3.5)
NetADC1_2_32: Pair_B (ADC1_2.32), main_stack_dual_channel (U3.4)
NetADC1_2_34: Pair_B (ADC1_2.34), main_stack_dual_channel (MS_T.101 MSB.20)
NetADC1_2_35: Pair_B (ADC1_2.35), main_stack_dual_channel (MS_T.102 MSB.19)
NetADC1_2_43: Pair_B (ADC1_2.43), Pair_B/Biasing_circuitry (C13_4.2 U2_4.3)
NetC24#2_2: main_stack_dual_channel (MS_T.118 MSB.3), sonar_peripherals (C24#2.2 D2.2 R12.2 R13.2)
NetC25_2: main_stack_dual_channel (MS_T.3 MSB.118), sonar_peripherals (C25.2 D3.2 R14.2 R16.2)
NetC26_2: main_stack_dual_channel (MS_T.117 MSB.4), sonar_peripherals (C26.2 D4.2 R15.2 R17.2)
NetC27_2: main_stack_dual_channel (MS_T.4 MSB.117), sonar_peripherals (C27.2 D5.2 R18.2 R20.2)
NetC28_2: main_stack_dual_channel (MS_T.116 MSB.5), sonar_peripherals (C28.2 D6.2 R19.2 R21.2)
NetC29_2: main_stack_dual_channel (MS_T.5 MSB.116), sonar_peripherals (C29.2 D7.2 R22.2 R23.2)
NetC30_2: main_stack_dual_channel (MS_T.115 MSB.6), sonar_peripherals (C30.2 D8.2 R24.2 R25.2)
NetC31_2: main_stack_dual_channel (MS_T.6 MSB.115), sonar_peripherals (C31.2 D9.2 R26.2 R27.2)
NetMS_T_97: main_stack_dual_channel (MS_T.97 MSB.24), sonar_peripherals (P3.9)
NetMS_T_98: main_stack_dual_channel (MS_T.98 MSB.23), sonar_peripherals (P3.7)
NetP3_8: main_stack_dual_channel (U3.6), sonar_peripherals (P3.8)